# EAGLE design teensy-jst_01.1 (EAGLE 9.7.0)
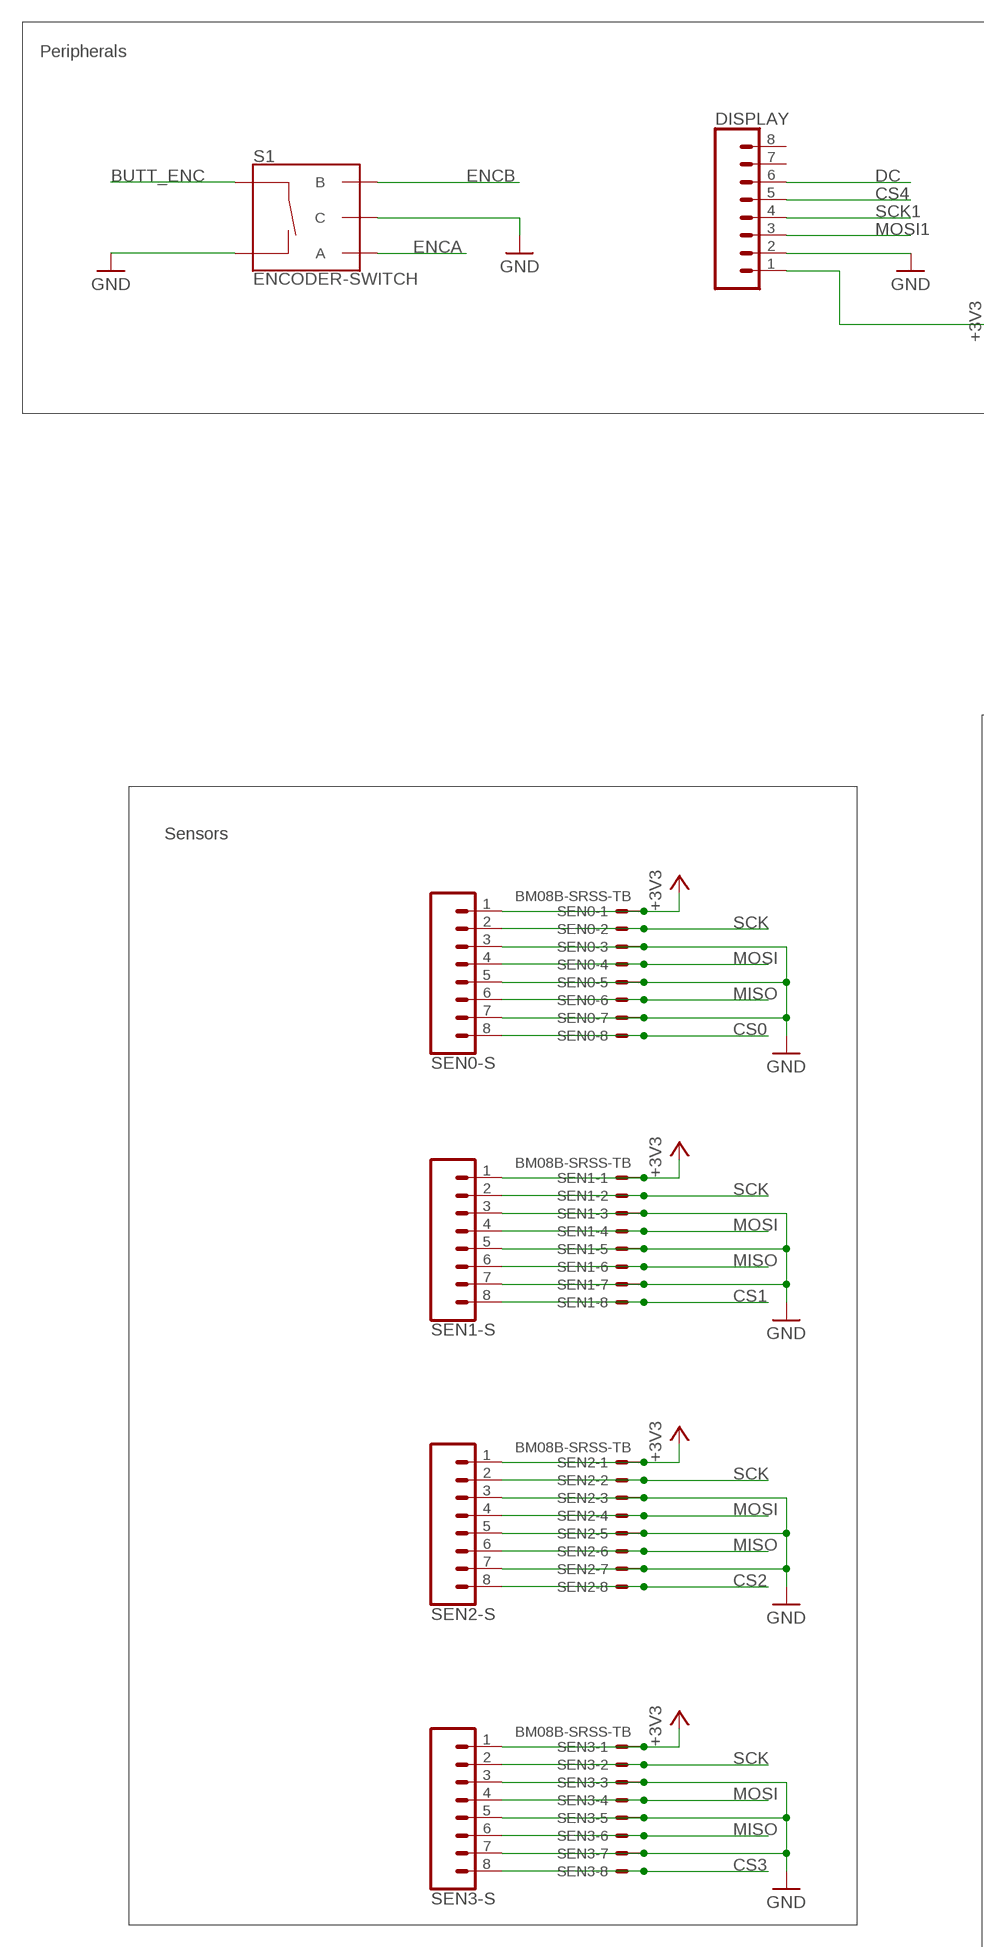
[diagram p0: schematic, sheet 1, part 1 of 2]
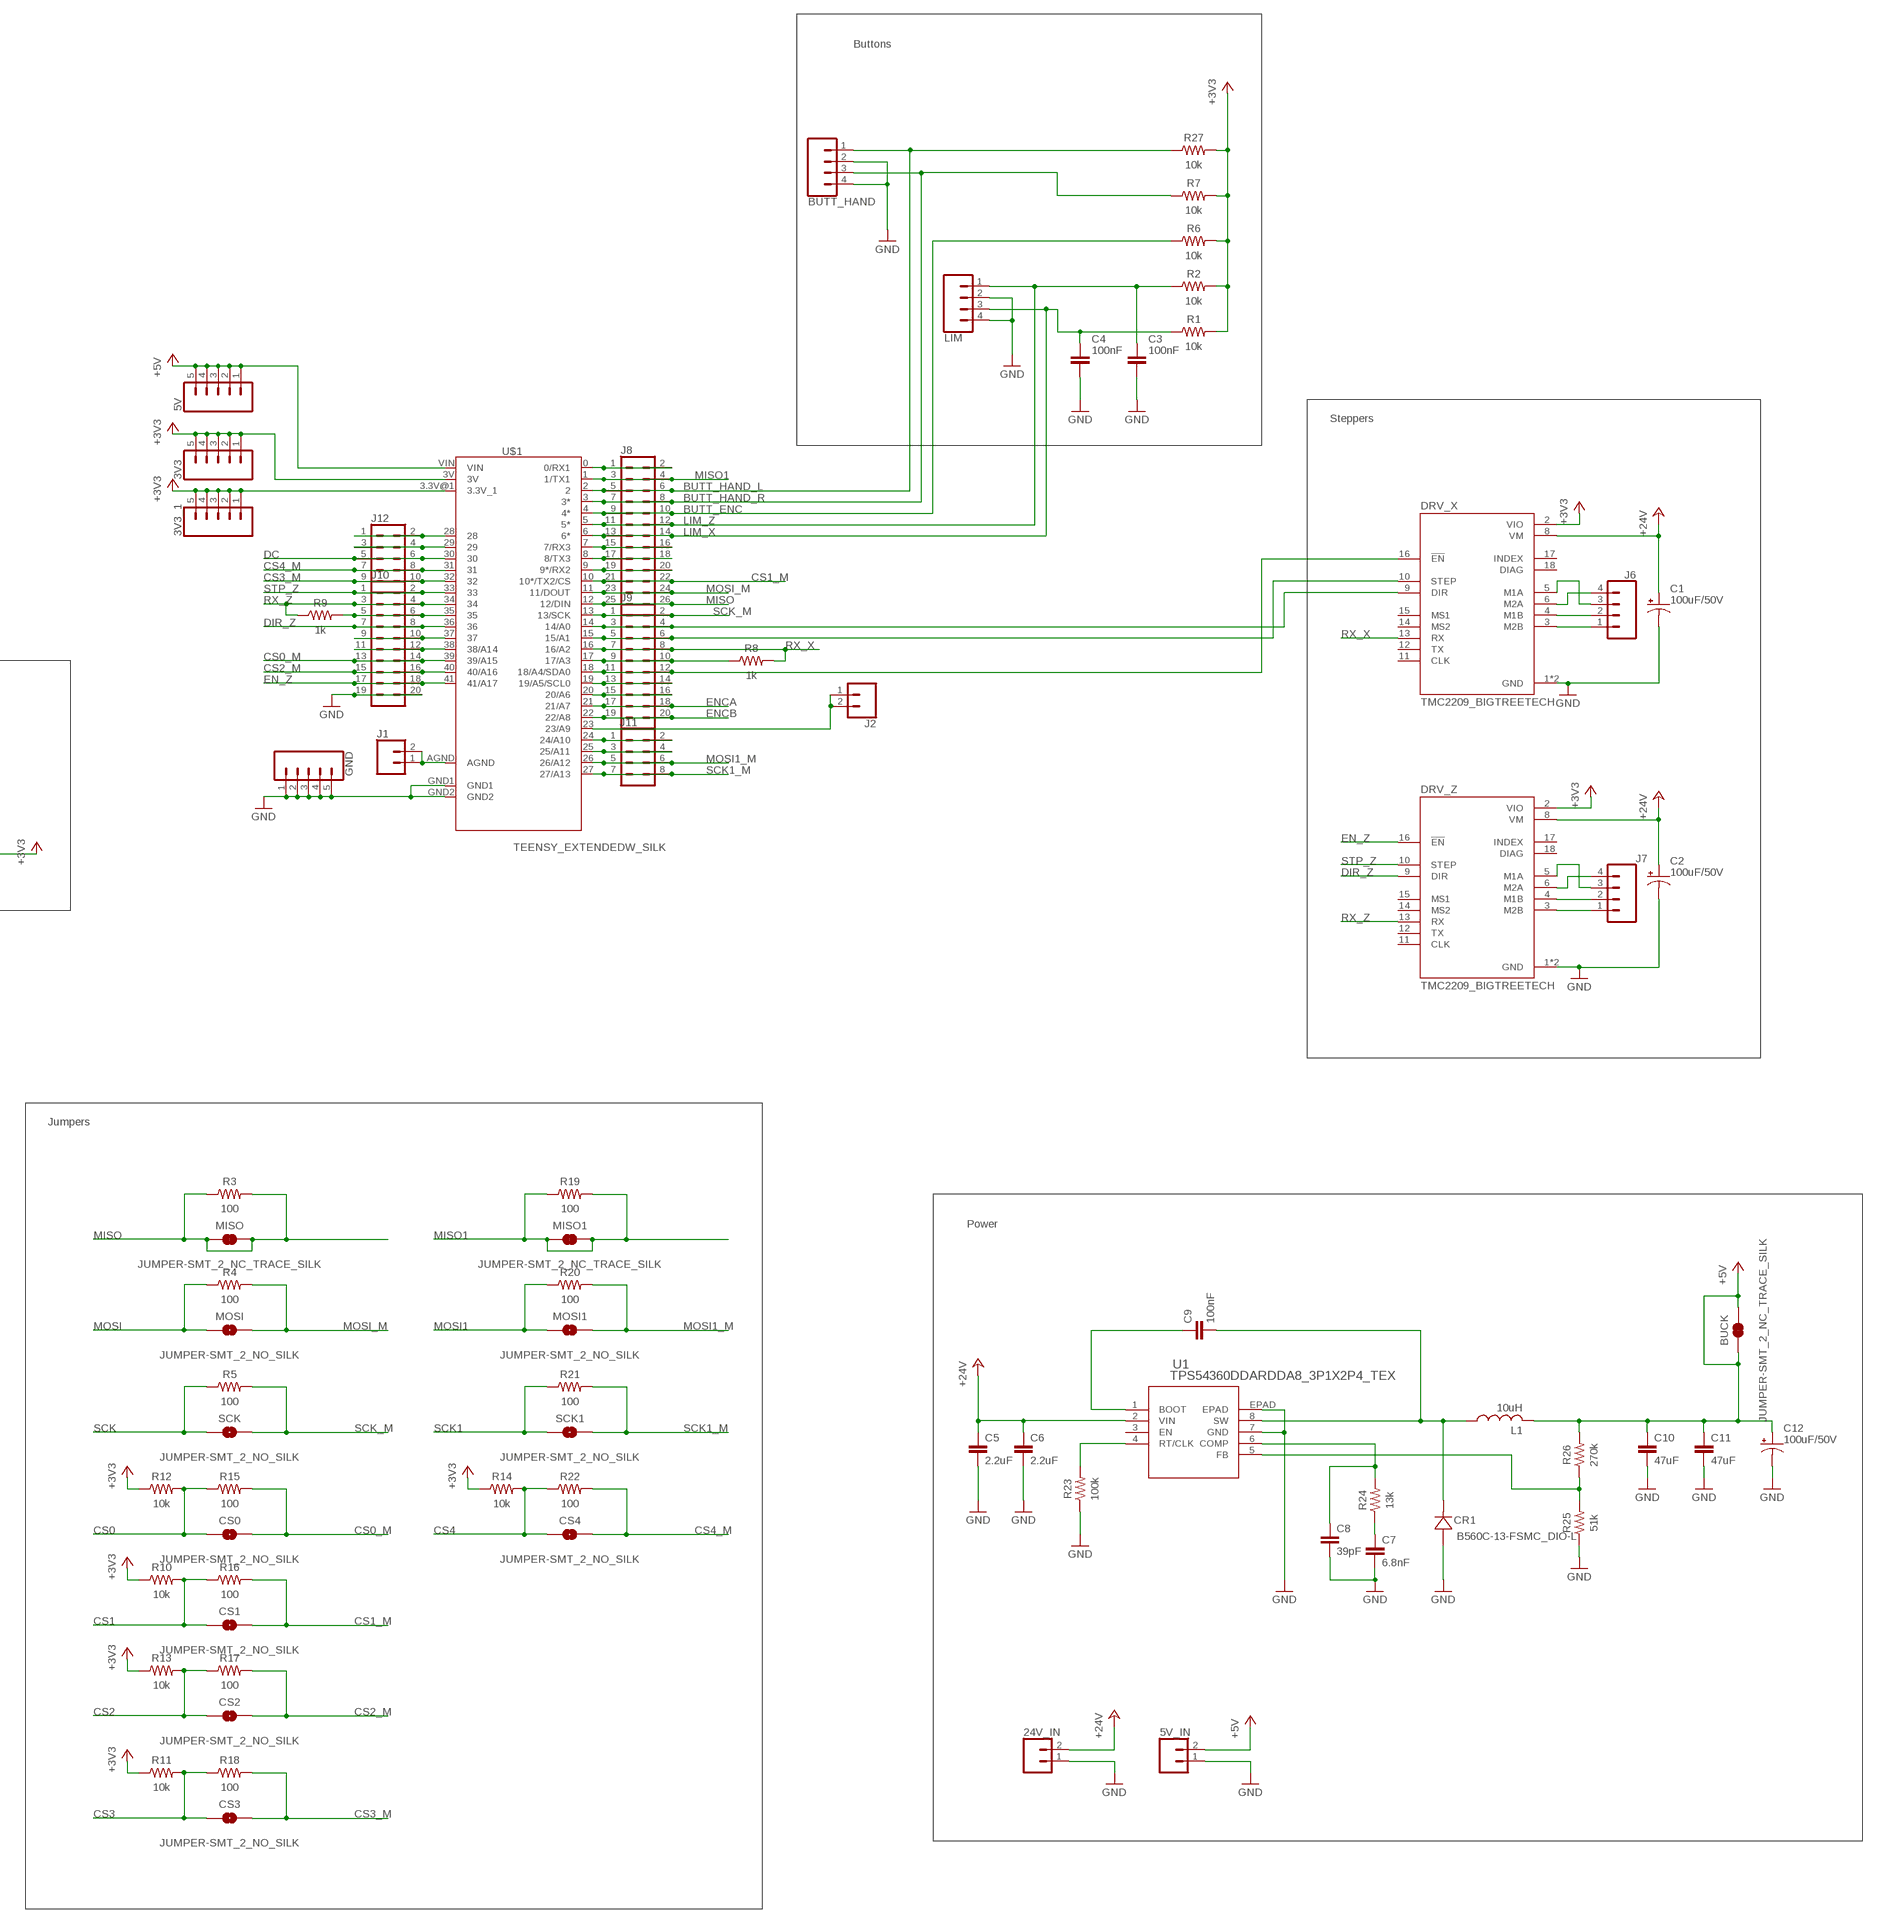
[diagram p1: schematic, sheet 1, part 2 of 2]

## Parts
3V3  CONN_05PTH  [1X05]
3V3_1  CONN_05PTH  [1X05]
5V  CONN_05PTH  [1X05]
5V_IN  CONN_025MM  [SCREWTERMINAL-5MM-2]
24V_IN  CONN_025MM  [SCREWTERMINAL-5MM-2]
BUCK  JUMPER-SMT_2_NC_TRACE_SILK  [SMT-JUMPER_2_NC_TRACE_SILK]
BUTT_HAND  CONN_041X04_NO_SILK  [1X04_NO_SILK]
C1  100uF/50V  CPOL-USE5-6  [E5-6]
C2  100uF/50V  CPOL-USE5-6  [E5-6]
C3  100nF  C-EUC0603  [C0603]
C4  100nF  C-EUC0603  [C0603]
C5  2.2uF  C-EUC0603  [C0603]
C6  2.2uF  C-EUC0603  [C0603]
C7  6.8nF  C-EUC0402  [C0402]
C8  39pF  C-EUC0402  [C0402]
C9  100nF  C-EUC0402  [C0402]
C10  47uF  C-EUC0603  [C0603]
C11  47uF  C-EUC0603  [C0603]
C12  100uF/50V  CPOL-USE5-6  [E5-6]
CR1  B560C-13-FSMC_DIO-L  [SMC_DIO-L]
CS0  JUMPER-SMT_2_NO_SILK  [SMT-JUMPER_2_NO_SILK]
CS1  JUMPER-SMT_2_NO_SILK  [SMT-JUMPER_2_NO_SILK]
CS2  JUMPER-SMT_2_NO_SILK  [SMT-JUMPER_2_NO_SILK]
CS3  JUMPER-SMT_2_NO_SILK  [SMT-JUMPER_2_NO_SILK]
CS4  JUMPER-SMT_2_NO_SILK  [SMT-JUMPER_2_NO_SILK]
DISPLAY  CONN_08"  [1X08]
DRV_X  TMC2209_BIGTREETECH  [MODULE_TMC2209_BIGTREETECH]
DRV_Z  TMC2209_BIGTREETECH  [MODULE_TMC2209_BIGTREETECH]
GND  CONN_05PTH  [1X05]
J1  CONN_02  [1X02]
J2  CONN_02  [1X02]
J6  CONN_04PTH  [1X04]
J7  CONN_04PTH  [1X04]
J8  CONN_13X22X13  [2X13]
J9  CONN_10X2  [2X10]
J10  CONN_10X2  [2X10]
J11  CONN_04X2  [2X4]
J12  CONN_05X2PTH  [2X5]
L1  10uH  L-USMWSA0503S-100MT  [MWSA0503S-100MT]
LIM  CONN_041X04_NO_SILK  [1X04_NO_SILK]
MISO  JUMPER-SMT_2_NC_TRACE_SILK  [SMT-JUMPER_2_NC_TRACE_SILK]
MISO1  JUMPER-SMT_2_NC_TRACE_SILK  [SMT-JUMPER_2_NC_TRACE_SILK]
MOSI  JUMPER-SMT_2_NO_SILK  [SMT-JUMPER_2_NO_SILK]
MOSI1  JUMPER-SMT_2_NO_SILK  [SMT-JUMPER_2_NO_SILK]
R1  10k  R-US_CHIP-0603(1608-METRIC)  [RESC1608X60]
R2  10k  R-US_CHIP-0603(1608-METRIC)  [RESC1608X60]
R3  100  R-US_CHIP-0603(1608-METRIC)  [RESC1608X60]
R4  100  R-US_CHIP-0603(1608-METRIC)  [RESC1608X60]
R5  100  R-US_CHIP-0603(1608-METRIC)  [RESC1608X60]
R6  10k  R-US_CHIP-0603(1608-METRIC)  [RESC1608X60]
R7  10k  R-US_CHIP-0603(1608-METRIC)  [RESC1608X60]
R8  1k  R-US_CHIP-0603(1608-METRIC)  [RESC1608X60]
R9  1k  R-US_CHIP-0603(1608-METRIC)  [RESC1608X60]
R10  10k  R-US_CHIP-0603(1608-METRIC)  [RESC1608X60]
R11  10k  R-US_CHIP-0603(1608-METRIC)  [RESC1608X60]
R12  10k  R-US_CHIP-0603(1608-METRIC)  [RESC1608X60]
R13  10k  R-US_CHIP-0603(1608-METRIC)  [RESC1608X60]
R14  10k  R-US_CHIP-0603(1608-METRIC)  [RESC1608X60]
R15  100  R-US_CHIP-0603(1608-METRIC)  [RESC1608X60]
R16  100  R-US_CHIP-0603(1608-METRIC)  [RESC1608X60]
R17  100  R-US_CHIP-0603(1608-METRIC)  [RESC1608X60]
R18  100  R-US_CHIP-0603(1608-METRIC)  [RESC1608X60]
R19  100  R-US_CHIP-0603(1608-METRIC)  [RESC1608X60]
R20  100  R-US_CHIP-0603(1608-METRIC)  [RESC1608X60]
R21  100  R-US_CHIP-0603(1608-METRIC)  [RESC1608X60]
R22  100  R-US_CHIP-0603(1608-METRIC)  [RESC1608X60]
R23  100k  R-US_CHIP-0402(1005-METRIC)  [RESC1005X40]
R24  13k  R-US_CHIP-0402(1005-METRIC)  [RESC1005X40]
R25  51k  R-US_CHIP-0402(1005-METRIC)  [RESC1005X40]
R26  270k  R-US_CHIP-0402(1005-METRIC)  [RESC1005X40]
R27  10k  R-US_CHIP-0603(1608-METRIC)  [RESC1608X60]
S1  ENCODER-SWITCH  [ROTARY_ENC_PLAIN]
SCK  JUMPER-SMT_2_NO_SILK  [SMT-JUMPER_2_NO_SILK]
SCK1  JUMPER-SMT_2_NO_SILK  [SMT-JUMPER_2_NO_SILK]
SEN0  BM08B-SRSS-TB  [BM08B-SRSS-TB]
SEN0-S  CONN_08"  [1X08]
SEN1  BM08B-SRSS-TB  [BM08B-SRSS-TB]
SEN1-S  CONN_08"  [1X08]
SEN2  BM08B-SRSS-TB  [BM08B-SRSS-TB]
SEN2-S  CONN_08"  [1X08]
SEN3  BM08B-SRSS-TB  [BM08B-SRSS-TB]
SEN3-S  CONN_08"  [1X08]
U1  TPS54360DDARDDA8_3P1X2P4_TEX  [DDA8_3P1X2P4_TEX]
U$1  TEENSY_EXTENDEDW_SILK  [TEENSY_EXTENDED]

## Nets
+3V3: 3V3.1 3V3.2 3V3.3 3V3.4 3V3.5 3V3_1.1 3V3_1.2 3V3_1.3 3V3_1.4 3V3_1.5 DISPLAY.1 DRV_X.2(VIO) DRV_Z.2(VIO) R1.2 R2.2 R6.2 R7.2 R10.1 R11.1 R12.1 R13.1 R14.1 R27.2 SEN0-S.1 SEN0.1 SEN1-S.1 SEN1.1 SEN2-S.1 SEN2.1 SEN3-S.1 SEN3.1 U$1.3.3V@1(3.3V_1) U$1.3V
+5V: 5V.1 5V.2 5V.3 5V.4 5V.5 5V_IN.2 BUCK.1 BUCK.2 C10.1 C11.1 C12.+ L1.2 R26.2 U$1.VIN
+24V: 24V_IN.2 C1.+ C2.+ C5.1 C6.1 DRV_X.8(VM) DRV_Z.8(VM) U1.2(VIN)
BUTT_ENC: J8.9 J8.10 R6.1 S1.SW+ U$1.4(4*)
BUTT_HAND_L: BUTT_HAND.1 J8.5 J8.6 R27.1 U$1.2
BUTT_HAND_R: BUTT_HAND.3 J8.7 J8.8 R7.1 U$1.3(3*)
CS0: CS0.1 R12.2 R15.1 SEN0-S.8 SEN0.8
CS0_M: CS0.2 J10.13 J10.14 R15.2 U$1.39(39/A15)
CS1: CS1.1 R10.2 R16.1 SEN1-S.8 SEN1.8
CS1_M: CS1.2 J8.21 J8.22 R16.2 U$1.10(10*/TX2/CS)
CS2: CS2.1 R13.2 R17.1 SEN2-S.8 SEN2.8
CS2_M: CS2.2 J10.15 J10.16 R17.2 U$1.40(40/A16)
CS3: CS3.1 R11.2 R18.1 SEN3-S.8 SEN3.8
CS3_M: CS3.2 J12.9 J12.10 R18.2 U$1.32
CS4: CS4.1 DISPLAY.5 R14.2 R22.1
CS4_M: CS4.2 J12.7 J12.8 R22.2 U$1.31
DC: DISPLAY.6 J12.5 J12.6 U$1.30
DIR_Z: DRV_Z.9(DIR) J10.7 J10.8 U$1.36
EN_Z: DRV_Z.16(!EN) J10.17 J10.18 U$1.41(41/A17)
ENCA: J9.17 J9.18 S1.A U$1.21(21/A7)
ENCB: J9.19 J9.20 S1.B U$1.22(22/A8)
GND: 5V_IN.1 24V_IN.1 BUTT_HAND.2 BUTT_HAND.4 C1.- C2.- C3.2 C4.2 C5.2 C6.2 C7.2 C8.2 C10.2 C11.2 C12.- CR1.2 DISPLAY.2 DRV_X.1(GND) DRV_X.7(GND) DRV_Z.1(GND) DRV_Z.7(GND) GND.1 GND.2 GND.3 GND.4 GND.5 J10.19 J10.20 LIM.2 LIM.4 R23.1 R25.1 S1.C S1.SW- SEN0-S.3 SEN0-S.5 SEN0-S.7 SEN0.3 SEN0.5 SEN0.7 SEN1-S.3 SEN1-S.5 SEN1-S.7 SEN1.3 SEN1.5 SEN1.7 SEN2-S.3 SEN2-S.5 SEN2-S.7 SEN2.3 SEN2.5 SEN2.7 SEN3-S.3 SEN3-S.5 SEN3-S.7 SEN3.3 SEN3.5 SEN3.7 U1.7(GND) U1.EPAD U$1.GND1 U$1.GND2
LIM_X: C4.1 J8.13 J8.14 LIM.3 R1.1 U$1.6(6*)
LIM_Z: C3.1 J8.11 J8.12 LIM.1 R2.1 U$1.5(5*)
MISO: J8.25 J8.26 MISO.1 MISO.2 R3.1 R3.2 SEN0-S.6 SEN0.6 SEN1-S.6 SEN1.6 SEN2-S.6 SEN2.6 SEN3-S.6 SEN3.6 U$1.12(12/DIN)
MISO1: J8.3 J8.4 MISO1.1 MISO1.2 R19.1 R19.2 U$1.1(1/TX1)
MOSI: MOSI.1 R4.1 SEN0-S.4 SEN0.4 SEN1-S.4 SEN1.4 SEN2-S.4 SEN2.4 SEN3-S.4 SEN3.4
MOSI1: DISPLAY.3 MOSI1.1 R20.1
MOSI1_M: J11.5 J11.6 MOSI1.2 R20.2 U$1.26(26/A12)
MOSI_M: J8.23 J8.24 MOSI.2 R4.2 U$1.11(11/DOUT)
MS1_Z: J10.9 J10.10 U$1.37
MS2_Z: J10.11 J10.12 U$1.38(38/A14)
N$1: J12.1 J12.2 U$1.28
N$3: J11.1 J11.2 U$1.24(24/A10)
N$4: J1.1 J1.2 U$1.AGND
N$5: J2.1 J2.2 U$1.23(23/A9)
N$6: J12.3 J12.4 U$1.29
N$7: R23.2 U1.4(RT/CLK)
N$8: J8.15 J8.16 U$1.7(7/RX3)
N$10: C7.1 R24.1
N$11: DRV_X.9(DIR) J9.3 J9.4 U$1.14(14/A0)
N$12: DRV_Z.6(M2A) J7.4
N$13: DRV_X.10(STEP) J9.5 J9.6 U$1.15(15/A1)
N$14: C8.1 R24.2 U1.6(COMP)
N$15: DRV_Z.5(M1A) J7.3
N$16: J9.13 J9.14 U$1.19(19/A5/SCL0)
N$17: DRV_X.6(M2A) J6.4
N$18: DRV_X.5(M1A) J6.3
N$19: R25.2 R26.1 U1.5(FB)
N$20: DRV_Z.4(M1B) J7.2
N$21: DRV_Z.3(M2B) J7.1
N$22: J11.3 J11.4 U$1.25(25/A11)
N$24: DRV_X.4(M1B) J6.2
N$25: DRV_X.3(M2B) J6.1
N$26: J9.15 J9.16 U$1.20(20/A6)
N$27: DRV_X.16(!EN) J9.11 J9.12 U$1.18(18/A4/SDA0)
N$28: J9.9 J9.10 R8.1 U$1.17(17/A3)
N$30: C9.2 CR1.1 L1.1 U1.8(SW)
N$32: C9.1 U1.1(BOOT)
N$33: J8.17 J8.18 U$1.8(8/TX3)
N$37: J8.1 J8.2 U$1.0(0/RX1)
N$39: J8.19 J8.20 U$1.9(9*/RX2)
N$41: J10.5 J10.6 R9.2 U$1.35
RX_X: DRV_X.13(RX) J9.7 J9.8 R8.2 U$1.16(16/A2)
RX_Z: DRV_Z.13(RX) J10.3 J10.4 R9.1 U$1.34
SCK: R5.1 SCK.1 SEN0-S.2 SEN0.2 SEN1-S.2 SEN1.2 SEN2-S.2 SEN2.2 SEN3-S.2 SEN3.2
SCK1: DISPLAY.4 R21.1 SCK1.1
SCK1_M: J11.7 J11.8 R21.2 SCK1.2 U$1.27(27/A13)
SCK_M: J9.1 J9.2 R5.2 SCK.2 U$1.13(13/SCK)
STP_Z: DRV_Z.10(STEP) J10.1 J10.2 U$1.33
Unconnected: DISPLAY.7 DISPLAY.8 DRV_X.11(CLK) DRV_X.12(TX) DRV_X.14(MS2) DRV_X.15(MS1) DRV_X.17(INDEX) DRV_X.18(DIAG) DRV_Z.11(CLK) DRV_Z.12(TX) DRV_Z.14(MS2) DRV_Z.15(MS1) DRV_Z.17(INDEX) DRV_Z.18(DIAG) U1.3(EN)

## Notes on the sheet
- Buttons
- Steppers
- Peripherals
- Jumpers
- Sensors
- Power

## Library data of the parts
3V3 3V3_1 5V GND = SparkFun-Connectors:CONN_05: Multi connection point. Often used as Generic Header-pin footprint for 0.1 inch spaced/style header connections On any of the 0.1 inch spaced packages, you can populate with these: Break Away Headers - Straight <https://www.sparkfun.com/products/116> (PRT-00116) Break Away Male Headers - Right Angle <https://www.sparkfun.com/products/553> (PRT-00553) Female Headers <https://www.sparkfun.com/products/115> (PRT-00115) Break Away Headers - Machine Pin <https://www.sparkfun.com/products/117> (PRT-00117) Break Away Female Headers - Swiss Machine Pin <https://www.sparkfun.com/products/743> (PRT-00743) For SCREWTERMINALS and SPRING TERMINALS visit here: Screw Terimnals on SparkFun.com <https://www.sparkfun.com/search/results?term=Screw+Terminals> (5mm/3.5mm/2.54mm spacing) This device is also useful as a general connection point to wire up your design to another part of your project. Our various solder wires solder well into these plated through hole pads. Hook-Up Wire - Assortment (Stranded, 22 AWG) <https://www.sparkfun.com/products/11375> (PRT-11375) Hook-Up Wire - Assortment (Solid Core, 22 AWG) <https://www.sparkfun.com/products/11367> (PRT-11367) View the entire wire category on our website here <https://www.sparkfun.com/categories/141> Special notes: Molex polarized connector foot print use with SKU : PRT-08231 with associated crimp pins and housings. 1MM SMD Version SKU: PRT-10208
5V_IN 24V_IN = SparkFun-Connectors:CONN_02: Multi connection point. Often used as Generic Header-pin footprint for 0.1 inch spaced/style header connections On any of the 0.1 inch spaced packages, you can populate with these: Break Away Headers - Straight <https://www.sparkfun.com/products/116> (PRT-00116) Break Away Male Headers - Right Angle <https://www.sparkfun.com/products/553> (PRT-00553) Female Headers <https://www.sparkfun.com/products/115> (PRT-00115) Break Away Headers - Machine Pin <https://www.sparkfun.com/products/117> (PRT-00117) Break Away Female Headers - Swiss Machine Pin <https://www.sparkfun.com/products/743> (PRT-00743) For SCREWTERMINALS and SPRING TERMINALS visit here: Screw Terimnals on SparkFun.com <https://www.sparkfun.com/search/results?term=Screw+Terminals> (5mm/3.5mm/2.54mm spacing) This device is also useful as a general connection point to wire up your design to another part of your project. Our various solder wires solder well into these plated through hole pads. Hook-Up Wire - Assortment (Stranded, 22 AWG) <https://www.sparkfun.com/products/11375> (PRT-11375) Hook-Up Wire - Assortment (Solid Core, 22 AWG) <https://www.sparkfun.com/products/11367> (PRT-11367) View the entire wire category on our website here <https://www.sparkfun.com/categories/141> Special notes: Molex polarized connector foot print use with: PRT-08233 with associated crimp pins and housings. 2.54_SCREWTERM for use with PRT-10571. 3.5mm Screw Terminal footprints for PRT-08084 5mm Screw Terminal footprints for use with PRT-08432; SF_SKU: PRT-08432
BUCK MISO MISO1 = SparkFun-Jumpers:JUMPER-SMT_2_NC_TRACE: Normally closed trace jumper This jumper has a trace between two pads so it's normally closed (NC). Use a razor knife to open the connection. For best results follow the IPC guidelines for cutting traces: Cutout at least 0.063 mm (0.005 in). Remove all loose material to clean up the cut area. Seal the cut with an approved epoxy. Reapply solder to reclose the connection.
BUTT_HAND J6 J7 LIM = SparkFun-Connectors:CONN_04: Multi connection point. Often used as Generic Header-pin footprint for 0.1 inch spaced/style header connections On any of the 0.1 inch spaced packages, you can populate with these: Break Away Headers - Straight <https://www.sparkfun.com/products/116> (PRT-00116) Break Away Male Headers - Right Angle <https://www.sparkfun.com/products/553> (PRT-00553) Female Headers <https://www.sparkfun.com/products/115> (PRT-00115) Break Away Headers - Machine Pin <https://www.sparkfun.com/products/117> (PRT-00117) Break Away Female Headers - Swiss Machine Pin <https://www.sparkfun.com/products/743> (PRT-00743) For SCREWTERMINALS and SPRING TERMINALS visit here: Screw Terimnals on SparkFun.com <https://www.sparkfun.com/search/results?term=Screw+Terminals> (5mm/3.5mm/2.54mm spacing) This device is also useful as a general connection point to wire up your design to another part of your project. Our various solder wires solder well into these plated through hole pads. Hook-Up Wire - Assortment (Stranded, 22 AWG) <https://www.sparkfun.com/products/11375> (PRT-11375) Hook-Up Wire - Assortment (Solid Core, 22 AWG) <https://www.sparkfun.com/products/11367> (PRT-11367) View the entire wire category on our website here <https://www.sparkfun.com/categories/141> Special notes: Molex polarized connector foot print use with SKU : PRT-08231 with associated crimp pins and housings. 1MM SMD Version SKU: PRT-10208; PROD_ID: CONN-09696
C1 C2 C12 = rcl:CPOL-US: POLARIZED CAPACITOR, American symbol; SPICEPREFIX: C
C3-C11 = rcl:C-EU: CAPACITOR, European symbol; SPICEPREFIX: C
CR1 = 2024-09-23_20-34-24_Library:B560C-13-F; COPYRIGHT: Copyright (C) 2024 Ultra Librarian. All rights reserved.; MANUFACTURER_PART_NUMBER: B560C-13-F; MFR_NAME: Diodes Inc
CS0 CS1-CS4 MOSI MOSI1 SCK SCK1 = SparkFun-Jumpers:JUMPER-SMT_2_NO: Normally open jumper This jumper has two pads in close proximity to each other. Apply solder to close the connection. Round pads are easier to solder for beginners, but are a lot larger. SparkFun Product that uses the round pads: SparkFun EL Sequencer <https://www.sparkfun.com/products/12781>
DISPLAY SEN0-S SEN1-S SEN2-S SEN3-S = SparkFun-Connectors:CONN_08: Multi connection point. Often used as Generic Header-pin footprint for 0.1 inch spaced/style header connections On any of the 0.1 inch spaced packages, you can populate with these: Break Away Headers - Straight <https://www.sparkfun.com/products/116> (PRT-00116) Break Away Male Headers - Right Angle <https://www.sparkfun.com/products/553> (PRT-00553) Female Headers <https://www.sparkfun.com/products/115> (PRT-00115) Break Away Headers - Machine Pin <https://www.sparkfun.com/products/117> (PRT-00117) Break Away Female Headers - Swiss Machine Pin <https://www.sparkfun.com/products/743> (PRT-00743) Arduino Stackable Header - 8 Pin <https://www.sparkfun.com/products/9279> (PRT-09279) For SCREWTERMINALS and SPRING TERMINALS visit here: Screw Terimnals on SparkFun.com <https://www.sparkfun.com/search/results?term=Screw+Terminals> (5mm/3.5mm/2.54mm spacing) This device is also useful as a general connection point to wire up your design to another part of your project. Our various solder wires solder well into these plated through hole pads. Hook-Up Wire - Assortment (Stranded, 22 AWG) <https://www.sparkfun.com/products/11375> (PRT-11375) Hook-Up Wire - Assortment (Solid Core, 22 AWG) <https://www.sparkfun.com/products/11367> (PRT-11367) View the entire wire category on our website here <https://www.sparkfun.com/categories/141> Special notes: Molex polarized connector foot print use with SKU : PRT-08231 with associated crimp pins and housings. 1MM SMD Version SKU: PRT-10208 NOTES ON THE VARIANTS LOCK and LOCK_LONGPADS... This footprint was designed to help hold the alignment of a through-hole component (i.e. 6-pin header) while soldering it into place. You may notice that each hole has been shifted either up or down by 0.005 of an inch from it's more standard position (which is a perfectly straight line). This slight alteration caused the pins (the squares in the middle) to touch the edges of the holes. Because they are alternating, it causes a "brace" to hold the component in place. 0.005 has proven to be the perfect amount of "off-center" position when using our standard breakaway headers. Although looks a little odd when you look at the bare footprint, once you have a header in there, the alteration is very hard to notice. Also,if you push a header all the way into place, it is covered up entirely on the bottom side.; PROD_ID: CONN-08438
DRV_X DRV_Z = TMC2209_BIGTREETECH:TMC2209_BIGTREETECH: Check availability <https://pricing.snapeda.com/parts/TMC2209%20SILENTSTEPSTICK/Trinamic%20Motion%20Control%20GmbH/view-part?ref=eda>; AVAILABILITY: In Stock; CHECK_PRICES: https://www.snapeda.com/parts/TMC2209%20SILENTSTEPSTICK/Trinamic+Motion+Control+GmbH/view-part/?ref=eda; DESCRIPTION: TMC2209 Motor Controller/Driver Power Management Evaluation Board; MF: Trinamic Motion Control GmbH; MP: TMC2209 SILENTSTEPSTICK; PACKAGE: None; PRICE: None; SNAPEDA_LINK: https://www.snapeda.com/parts/TMC2209%20SILENTSTEPSTICK/Trinamic+Motion+Control+GmbH/view-part/?ref=snap
J1 J2 = SparkFun-Connectors:CONN_02: Multi connection point. Often used as Generic Header-pin footprint for 0.1 inch spaced/style header connections On any of the 0.1 inch spaced packages, you can populate with these: Break Away Headers - Straight <https://www.sparkfun.com/products/116> (PRT-00116) Break Away Male Headers - Right Angle <https://www.sparkfun.com/products/553> (PRT-00553) Female Headers <https://www.sparkfun.com/products/115> (PRT-00115) Break Away Headers - Machine Pin <https://www.sparkfun.com/products/117> (PRT-00117) Break Away Female Headers - Swiss Machine Pin <https://www.sparkfun.com/products/743> (PRT-00743) For SCREWTERMINALS and SPRING TERMINALS visit here: Screw Terimnals on SparkFun.com <https://www.sparkfun.com/search/results?term=Screw+Terminals> (5mm/3.5mm/2.54mm spacing) This device is also useful as a general connection point to wire up your design to another part of your project. Our various solder wires solder well into these plated through hole pads. Hook-Up Wire - Assortment (Stranded, 22 AWG) <https://www.sparkfun.com/products/11375> (PRT-11375) Hook-Up Wire - Assortment (Solid Core, 22 AWG) <https://www.sparkfun.com/products/11367> (PRT-11367) View the entire wire category on our website here <https://www.sparkfun.com/categories/141> Special notes: Molex polarized connector foot print use with: PRT-08233 with associated crimp pins and housings. 2.54_SCREWTERM for use with PRT-10571. 3.5mm Screw Terminal footprints for PRT-08084 5mm Screw Terminal footprints for use with PRT-08432
J8 = SparkFun-Connectors:CONN_13X2: Multi connection point. Often used as Generic Header-pin footprint for 0.1 inch spaced/style header connections On any of the 0.1 inch spaced packages, you can populate with these: Break Away Headers - Straight <https://www.sparkfun.com/products/116> (PRT-00116) Break Away Male Headers - Right Angle <https://www.sparkfun.com/products/553> (PRT-00553) Female Headers <https://www.sparkfun.com/products/115> (PRT-00115) Break Away Headers - Machine Pin <https://www.sparkfun.com/products/117> (PRT-00117) Break Away Female Headers - Swiss Machine Pin <https://www.sparkfun.com/products/743> (PRT-00743)
J9 J10 = SparkFun-Connectors:CONN_10X2: Multi connection point. Often used as Generic Header-pin footprint for 0.1 inch spaced/style header connections On any of the 0.1 inch spaced packages, you can populate with these: Break Away Headers - Straight <https://www.sparkfun.com/products/116> (PRT-00116) Break Away Male Headers - Right Angle <https://www.sparkfun.com/products/553> (PRT-00553) Female Headers <https://www.sparkfun.com/products/115> (PRT-00115) Break Away Headers - Machine Pin <https://www.sparkfun.com/products/117> (PRT-00117) Break Away Female Headers - Swiss Machine Pin <https://www.sparkfun.com/products/743> (PRT-00743) Special note about the "SPECIAL" package: This was SPECIALLY designed to be used with our Graphic LCD Backpack. Be sure you want to use this! It is not only staggered on each line of header holes, but IT IS ALSO offset of the center point of the top and bottom lines by 5 mil. This causes the headers to lock into place on the "standard" footprint on the LCD screen. The extra squares on the tdocu layer are there simply to reference other pins (if you were to actually populate a longer header than ten long - this is what we do with the backpacks).
J11 = SparkFun-Connectors:CONN_04X2: Multi connection point. Often used as Generic Header-pin footprint for 0.1 inch spaced/style header connections On any of the 0.1 inch spaced packages, you can populate with these: Break Away Headers - Straight <https://www.sparkfun.com/products/116> (PRT-00116) Break Away Male Headers - Right Angle <https://www.sparkfun.com/products/553> (PRT-00553) Female Headers <https://www.sparkfun.com/products/115> (PRT-00115) Break Away Headers - Machine Pin <https://www.sparkfun.com/products/117> (PRT-00117) Break Away Female Headers - Swiss Machine Pin <https://www.sparkfun.com/products/743> (PRT-00743)
J12 = SparkFun-Connectors:CONN_05X2: Multi connection point. Often used as Generic Header-pin footprint for 0.1 inch spaced/style header connections For AVR SPI programming port, see special device with nice symbol: "AVR_SPI_PROG_5x2.dev" You can populate with any combo of single row headers, but if you'd like an exact match, check these: 2x5 AVR ICSP Male Header <https://www.sparkfun.com/products/778> (PRT-00778) 2x5 Pin Shrouded Header <https://www.sparkfun.com/products/8506> (PRT-08506) On any of the 0.1 inch spaced packages, you can populate with these: Break Away Headers - Straight <https://www.sparkfun.com/products/116> (PRT-00116) Break Away Male Headers - Right Angle <https://www.sparkfun.com/products/553> (PRT-00553) Female Headers <https://www.sparkfun.com/products/115> (PRT-00115) Break Away Headers - Machine Pin <https://www.sparkfun.com/products/117> (PRT-00117) Break Away Female Headers - Swiss Machine Pin <https://www.sparkfun.com/products/743> (PRT-00743) Special note: the shrouded connector mates well with our 5x2 ribbon cables: 2x5 Pin IDC Ribbon Cable <https://www.sparkfun.com/products/8535> (PRT-08535); PROD_ID: CONN-08499; SF_ID: PRT-0778
L1 = rcl-buck:L-US: INDUCTOR, American symbol
R1-R27 = Resistor:R-US: Resistor Fixed - ANSI; CATEGORY: Resistor; SUB-CATEGORY: Fixed
S1 = SparkFun-Switches:ENCODER-SWITCH: Rotary Encoder w/ Select Switch Encoders rotate similarly to potentiometers, but they’re different from potentiometers in that an encoder has full rotation without limits. They output gray code so that you can tell how much and in which direction the encoder has been turned. This encoder includes a push-down select switch built into the shaft. SparkFun Products Rotary Encoder <https://www.sparkfun.com/products/9117> (COM-09117); SF_SKU: COM-09117
SEN0 SEN1-SEN3 = con-jst2:?M08B-SRSS-TB: Disconnectable Crimp style connector, 1.0mm pitch 8 contacts
U1 = 2024-09-23_20-06-51_Library:TPS54360DDAR; COPYRIGHT: Copyright (C) 2024 Ultra Librarian. All rights reserved.; MANUFACTURER_PART_NUMBER: TPS54360DDAR; MFR_NAME: Texas Instruments
U$1 = TEENSY-4.1_CLEAN:TEENSY_EXTENDED: Teensy Footprint Extended Mechanical footprint with connectors for Teensy Development Board with ARM Cortex. SparkFun Products: Teensy 4.1 <https://www.sparkfun.com/products/16771> Teensy 3.6 <https://www.sparkfun.com/products/14057> Teensy 3.5 <https://www.sparkfun.com/products/14055> SparkFun Qwiic Shield for Teensy Extended <https://www.sparkfun.com/products/17156> Teensy Stackable Header Kit (Longer Version) <https://www.sparkfun.com/products/17152>

## Board
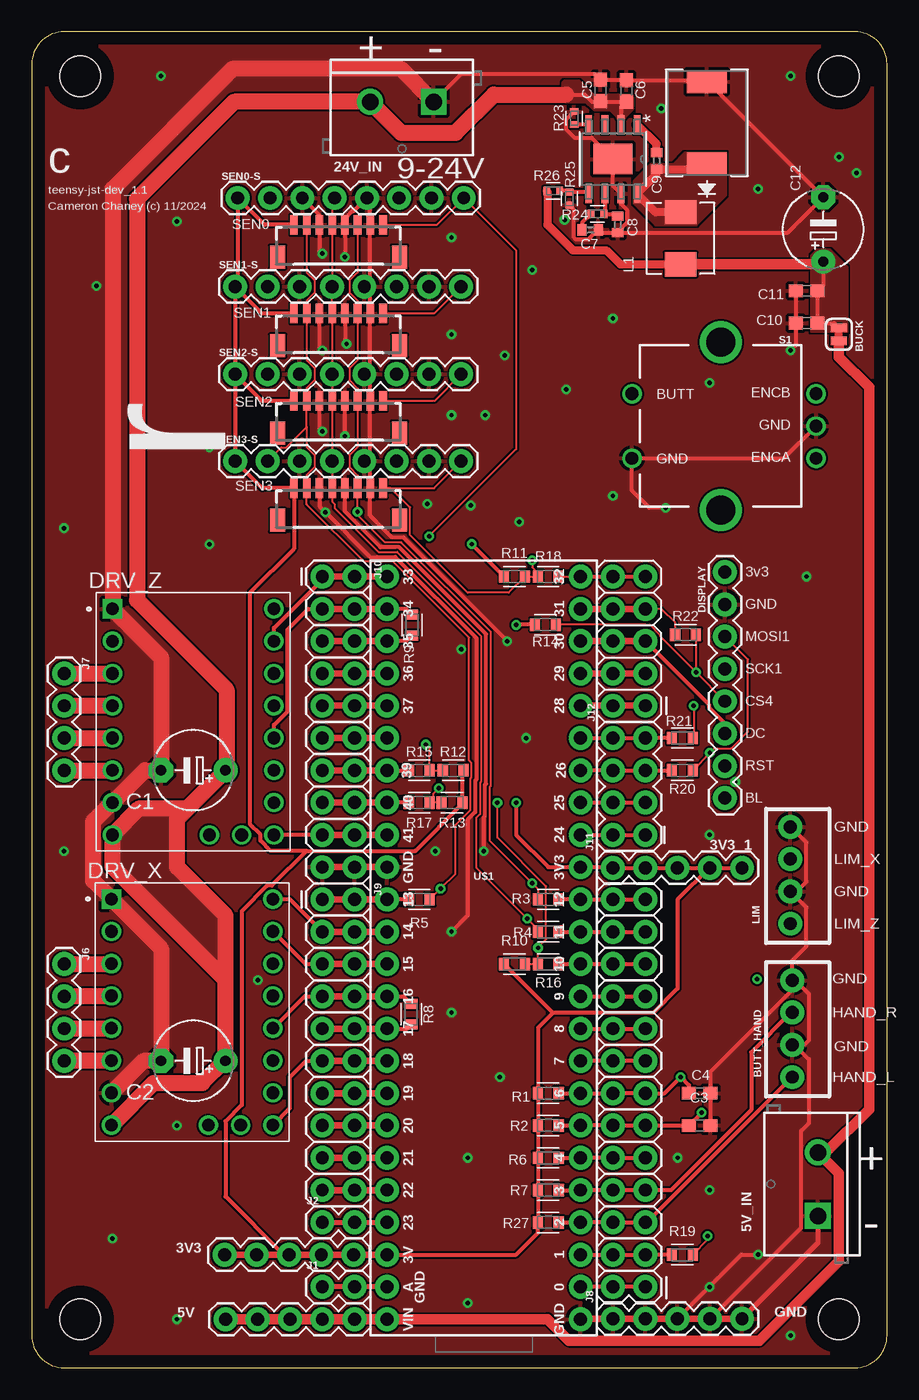
[diagram p2: board, top side]
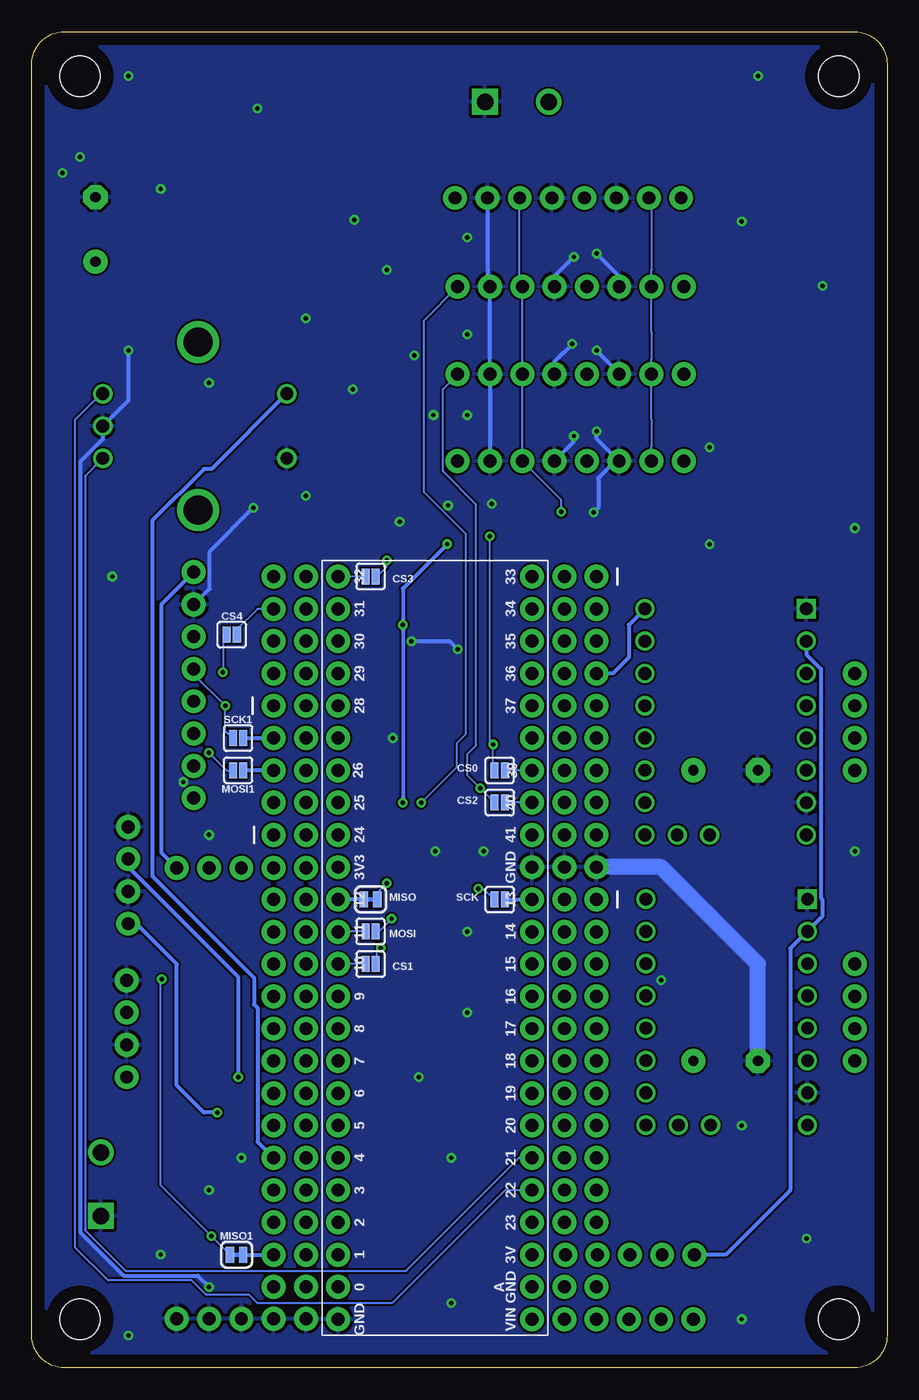
[diagram p3: board, bottom side, seen from below]

Size 67.29 x 105.08 mm. Coordinates in mm from the lower left corner, seen from the top.
Outline: 0,102.54 0,2.54 arc90 2.54,0 64.75,0 arc90 67.29,2.54 67.29,102.54 arc90 64.75,105.08 2.54,105.08 arc90 0,102.54
Copper layers (1*16): Top 0.035mm / dielectric 1.5mm / Bottom 0.035mm
Design rules "Fusion Electronics Design Rules": minimum track width 6mil, minimum drill 0.35mm, track to track 6mil, track to pad 6mil, pad to pad 6mil, via to via 6mil, smd to smd 6mil, copper to edge 40mil, drill to drill 6mil, minimum pad ring 10mil, minimum via ring 8mil, stop-mask expansion 4mil, vias tented up to drill 0mil, thermal gap 10mil
Holes 3.2 mm at 3.81,3.81 63.5,3.81 3.81,101.6 63.5,101.6

### Footprints (pad centres in the part's own frame; a part is rotated, then mirrored left to right if it is on the bottom)
1X05 = drill 1.016 pad 1.88: 1 0,0; 2 2.54,0; 3 5.08,0; 4 7.62,0; 5 10.16,0
SCREWTERMINAL-5MM-2 = drill 1.3 pad 2.032 square: 1 0,0 | drill 1.3 pad 2.032: 2 5,0
SMT-JUMPER_2_NC_TRACE_SILK = smd 0.66 x 1.27: 1 -0.521,0; 2 0.521,0
1X04_NO_SILK = drill 1.016 pad 1.88: 1 0,0; 2 2.54,0; 3 5.08,0; 4 7.62,0
E5-6 = drill 0.813 pad 1.905: + -2.54,0 | drill 0.813 pad 1.905 octagon: - 2.54,0
C0603 = smd 1.1 x 1: 1 -0.85,0; 2 0.85,0
C0402 = smd 0.7 x 0.9: 1 -0.65,0; 2 0.65,0
SMC_DIO-L = smd 1.799 x 3.129: 1 -3.241,0; 2 3.241,0
SMT-JUMPER_2_NO_SILK = smd 0.635 x 1.27: 1 -0.406,0; 2 0.406,0
1X08 = drill 1.016 pad 1.88: 1 0,0; 2 2.54,0; 3 5.08,0; 4 7.62,0; 5 10.16,0; 6 12.7,0; 7 15.24,0; 8 17.78,0
MODULE_TMC2209_BIGTREETECH = drill 1 square: 1 -6.35,8.89 | drill 1: 2 -6.35,6.35; 3 -6.35,3.81; 4 -6.35,1.27; 5 -6.35,-1.27; 6 -6.35,-3.81; 7 -6.35,-6.35; 8 -6.35,-8.89; 9 6.35,8.89; 10 6.35,6.35; 11 6.35,3.81; 12 6.35,1.27; 13 6.35,-1.27; 14 6.35,-3.81; 15 6.35,-6.35; 16 6.35,-8.89; 17 1.27,-8.89; 18 3.81,-8.89
1X02 = drill 1.016 pad 1.88: 1 0,0; 2 2.54,0
1X04 = drill 1.016 pad 1.88: 1 0,0; 2 2.54,0; 3 5.08,0; 4 7.62,0
2X13 = drill 1.016 pad 1.88: 1 0,0; 2 0,2.54; 3 2.54,0; 4 2.54,2.54; 5 5.08,0; 6 5.08,2.54; 7 7.62,0; 8 7.62,2.54; 9 10.16,0; 10 10.16,2.54; 11 12.7,0; 12 12.7,2.54; 13 15.24,0; 14 15.24,2.54; 15 17.78,0; 16 17.78,2.54; 17 20.32,0; 18 20.32,2.54; 19 22.86,0; 20 22.86,2.54; 21 25.4,0; 22 25.4,2.54; 23 27.94,0; 24 27.94,2.54; 25 30.48,0; 26 30.48,2.54
2X10 = drill 1.016 pad 1.88: 1 0,0; 2 0,2.54; 3 2.54,0; 4 2.54,2.54; 5 5.08,0; 6 5.08,2.54; 7 7.62,0; 8 7.62,2.54; 9 10.16,0; 10 10.16,2.54; 11 12.7,0; 12 12.7,2.54; 13 15.24,0; 14 15.24,2.54; 15 17.78,0; 16 17.78,2.54; 17 20.32,0; 18 20.32,2.54; 19 22.86,0; 20 22.86,2.54
2X4 = drill 1.016 pad 1.88: 1 -3.81,-1.27; 2 -3.81,1.27; 3 -1.27,-1.27; 4 -1.27,1.27; 5 1.27,-1.27; 6 1.27,1.27; 7 3.81,-1.27; 8 3.81,1.27
2X5 = drill 1.016 pad 1.88: 1 0,0; 2 0,2.54; 3 2.54,0; 4 2.54,2.54; 5 5.08,0; 6 5.08,2.54; 7 7.62,0; 8 7.62,2.54; 9 10.16,0; 10 10.16,2.54
MWSA0503S-100MT = smd 1.9 x 2.499: 1 2.05,0; 2 -2.05,0
RESC1608X60 = smd 0.799 x 0.974: 1 -0.815,0; 2 0.815,0
RESC1005X40 = smd 0.535 x 0.644: 1 -0.507,0; 2 0.507,0
ROTARY_ENC_PLAIN = drill 1.016: A 7.493,-2.54; B 7.493,2.54; C 7.493,0; SW+ -6.985,2.54; SW- -6.985,-2.54 | drill 2.286: P$3 0,6.604; P$4 0,-6.604
BM08B-SRSS-TB = smd 0.6 x 1.55: 1 3.5,-1.625; 2 2.5,-1.625; 3 1.5,-1.625; 4 0.5,-1.625; 5 -0.5,-1.625; 6 -1.5,-1.625; 7 -2.5,-1.625; 8 -3.5,-1.625 | smd 1.2 x 1.8: FIT@1 4.8,0.9; FIT@2 -4.8,0.9
DDA8_3P1X2P4_TEX = smd 1.46 x 0.533: 1 -2.724,1.905; 2 -2.724,0.635; 3 -2.724,-0.635; 4 -2.724,-1.905; 5 2.724,-1.905; 6 2.724,-0.635; 7 2.724,0.635; 8 2.724,1.905 | smd 2.4 x 3.1: EPAD 0,0
TEENSY_EXTENDED = drill 1.016 pad 1.88: 0 7.62,-13.97; 1 7.62,-11.43; 2 7.62,-8.89; 3 7.62,-6.35; 3.3V@1 7.62,19.05; 3V -7.62,-11.43; 4 7.62,-3.81; 5 7.62,-1.27; 6 7.62,1.27; 7 7.62,3.81; 8 7.62,6.35; 9 7.62,8.89; 10 7.62,11.43; 11 7.62,13.97; 12 7.62,16.51; 13 -7.62,16.51; 14 -7.62,13.97; 15 -7.62,11.43; 16 -7.62,8.89; 17 -7.62,6.35; 18 -7.62,3.81; 19 -7.62,1.27; 20 -7.62,-1.27; 21 -7.62,-3.81; 22 -7.62,-6.35; 23 -7.62,-8.89; 24 7.62,21.59; 25 7.62,24.13; 26 7.62,26.67; 27 7.62,29.21; 28 7.62,31.75; 29 7.62,34.29; 30 7.62,36.83; 31 7.62,39.37; 32 7.62,41.91; 33 -7.62,41.91; 34 -7.62,39.37; 35 -7.62,36.83; 36 -7.62,34.29; 37 -7.62,31.75; 38 -7.62,29.21; 39 -7.62,26.67; 40 -7.62,24.13; 41 -7.62,21.59; AGND -7.62,-13.97; GND1 7.62,-16.51; GND2 -7.62,19.05; VIN -7.62,-16.51

### Placement (x,y rotation side)
3V3  15.16,8.89 0 top
3V3_1  45.72,39.32 0 top
5V  15.24,3.81 0 top
5V_IN  61.85,11.94 90 top
24V_IN  31.62,99.57 180 top
BUCK  63.5,81.28 90 top
BUTT_HAND  59.82,22.86 90 top
C1  12.7,46.99 180 top
C2  12.7,24.13 180 top
C3  52.55,19.05 0 top
C4  52.55,21.59 0 top
C5  44.73,100.46 90 top
C6  46.78,100.44 90 top
C7  43.94,89.5 0 top
C8  46.1,89.92 270 top
C9  49.15,94.93 270 top
C10  60.96,82.17 180 top
C11  60.96,84.71 180 top
C12  62.27,89.53 90 top
CR1  53.12,97.92 90 top
CS0  30.48,46.99 0 bottom
CS1  40.64,31.75 180 bottom
CS2  30.48,44.45 0 bottom
CS3  40.64,62.23 180 bottom
CS4  51.56,57.66 0 bottom
DISPLAY  54.54,62.58 270 top
DRV_X  12.62,27.97 0 top
DRV_Z  12.7,50.8 0 top
GND  45.72,3.86 0 top
J1  22.86,6.35 0 top
J2  22.86,11.43 0 top
J6  2.54,31.75 270 top
J7  2.54,54.61 270 top
J8  48.26,6.35 90 top
J9  22.86,36.83 270 top
J10  22.86,62.23 270 top
J11  46.99,45.72 90 top
J12  48.26,52.07 90 top
L1  51.04,88.83 90 top
LIM  59.69,34.92 90 top
MISO  40.64,36.83 0 bottom
MISO1  51.18,8.89 180 bottom
MOSI  40.64,34.32 180 bottom
MOSI1  51.05,46.99 0 bottom
R1  40.64,21.59 180 top
R2  40.64,19.05 180 top
R3  40.64,36.83 0 top
R4  40.64,34.29 0 top
R5  30.48,36.83 180 top
R6  40.64,16.51 180 top
R7  40.64,13.97 180 top
R8  29.85,27.81 90 top
R9  29.92,58.42 270 top
R10  37.97,31.75 0 top
R11  37.97,62.23 0 top
R12  33.15,46.99 180 top
R13  33.06,44.45 180 top
R14  40.41,58.45 0 top
R15  30.48,46.99 180 top
R16  40.64,31.75 0 top
R17  30.48,44.45 180 top
R18  40.64,62.23 0 top
R19  51.18,8.89 0 top
R20  51.18,46.99 180 top
R21  51.18,49.53 180 top
R22  51.44,57.66 180 top
R23  42.67,98.3 270 top
R24  44.5,90.75 0 top
R25  42.29,91.95 90 top
R26  41.02,92.56 180 top
R27  40.64,11.43 180 top
S1  54.21,74.07 0 top
SCK  30.48,36.83 0 bottom
SCK1  51.05,49.53 0 bottom
SEN0  24.13,88.27 180 top
SEN0-S  16.21,92.01 0 top
SEN1  24.13,81.3 180 top
SEN1-S  16,85.04 0 top
SEN2  24.13,74.42 180 top
SEN2-S  16,78.15 0 top
SEN3  24.13,67.56 180 top
SEN3-S  16,71.31 0 top
U1  45.72,95.06 270 top
U$1  35.56,20.32 0 top

### Tracks (layer width: path | path; a pad name or v marks a point on that pad's centre or on a via)
+3V3  (via drill 0.35)
  Top 0.305: 3V3_1.4 3V3_1.3 3V3_1.2 3V3_1.1 45.67,39.37 U$1.3.3V@1 40.64,39.37 38.1,41.91 v38.1,44.45 | 3V3_1.4 3V3_1.5 | 40.99,27.91 48.9,27.91 50.8,29.82 50.8,36.83 53.29,39.32 3V3_1.4 | 22.86,8.89 3V3.4 19.83,8.89 15.24,13.48 15.24,19.39 16.51,20.66 16.51,35.9 18.53,37.92 18.87,37.92 21.62,40.66 | R12.1 33.88,46.9 R13.1 33.88,44.36 30.18,40.66 21.62,40.66 | R10.1 40.99,27.91 | v34.6,64.79 R11.1 | 40.99,27.91 39.83,26.75 R1.2 R2.2 R6.2 R7.2 R27.2 39.83,10.62 38.1,8.89 U$1.3V | R14.1 38.13,58.45 v38.1,58.42 | 21.62,40.66 18.8,40.66 17.99,41.47 17.99,41.93 17.2,42.72 17.2,60.96 20.63,64.39 SEN3.1 18.12,69.19 SEN3-S.1 SEN2-S.1 | SEN2.1 18.11,76.05 SEN2-S.1 | SEN1.1 18.12,82.92 SEN1-S.1 | SEN0.1 18.33,89.89 SEN0-S.1 16.21,85.25 SEN1-S.1 | SEN1-S.1 SEN2-S.1
  Top 0.508: 3V3.1 3V3.2 3V3.3 3V3.4 3V3.5 | 22.86,8.89 3V3.5 | 3V3.5 U$1.3V
  Bottom 0.305: 3V3.1 12.7,8.89 7.62,13.97 7.62,32.97 DRV_X.2 5.08,35.51 5.08,36.83 5.21,36.96 5.21,54.97 6.35,56.11 DRV_Z.2 | 3V3_1.5 57.1,40.54 57.1,60.02 DISPLAY.1 | v34.6,64.79 38.1,61.29 v38.1,58.42 v38.1,44.45
+5V
  Top 0.305: C12.+ 62.27,85.17 C11.1 C10.1 63.13,82.17 BUCK.2
  Top 0.61: L1.2 46.29,86.78 45.19,87.88 42.56,87.88 40.55,89.9 40.55,92.53 R26.2 | BUCK.1 BUCK.2
  Top 0.813: 5V.1 5V.2 5V.3 5V.4 5V.5 U$1.VIN 40.59,3.81 42.26,2.13 57.26,2.13 63.5,8.38 63.5,15.29 5V_IN.2 62.49,16.94 65.87,20.32 65.87,77.12 63.5,79.49 BUCK.1 | L1.2 62.06,86.78 C12.+
  pour Top (isolate 0.254, no thermals): 61.29,81.48 64.19,81.48 64.19,86.58 62.83,87.93 61.75,87.93 61.29,87.47
+24V
  Top 0.305: U1.2 46.36,99.17 C6.1 44.75,99.59 C5.1 44.7,99.57 44.07,99.57 43.51,100.13 42.04,100.13
  Top 1.27: C2.+ 15.24,30.51 6.35,39.4 DRV_Z.8 8.42,43.98 12.23,43.98 C1.+ | C2.+ 15.24,35.56 11.43,39.37 11.43,43.18 C1.+ | C1.+ 15.33,47.08 15.33,53.33 8.28,60.38 8.28,91.95 15.9,99.57 24V_IN.2 29.06,97.13 33.35,97.13 36.34,100.13 42.04,100.13 | DRV_X.8 9.58,22.39 13.42,22.39 15.16,24.13 C2.+
  pour Top (isolate 0.254, no thermals): 45.62,99.18 45.72,99.13 46.3,98.55 46.35,98.45 46.36,98.45 46.36,98.45 46.41,98.55 46.96,99.1 46.96,99.8 44.14,99.8 44.04,99.82 43.95,99.88 42.88,100.94 42.06,100.94 42.06,99.85 43.61,99.85 43.72,99.82 43.81,99.77 44.36,99.21 45.52,99.21
  pour Top (no thermals): 6.43,41.88 6.43,39.57 6.49,39.57 6.52,39.56 15.04,31.04 15.04,36.04 11.37,39.71 11.35,39.74 11.35,43.87 8.33,43.87 8.33,43.8 8.32,43.77
BUTT_ENC
  Top 0.305: J8.9 J8.10 U$1.4 R6.1
  Bottom 0.305: S1.SW+ 53.14,70.69 53.75,70.69 57.81,66.63 57.81,38.68 49.81,30.68 49.81,28.57 49.53,28.29 49.53,17.78 J8.9
BUTT_HAND_L
  Top 0.305: BUTT_HAND.1 48.39,11.43 J8.5 J8.6 U$1.2 R27.1
BUTT_HAND_R
  Top 0.305: R7.1 U$1.3 J8.8 J8.7 50.28,13.97 56.59,20.28 56.59,24.82 59.71,27.94 BUTT_HAND.3
CS0  (via drill 0.35)
  Top 0.152: R12.2 R15.1 31.3,48.72 v30.99,49.02 | SEN0.8 31.86,89.89 SEN0-S.8 38.1,87.9 38.1,72.24 v31.27,65.41
  Bottom 0.152: v31.27,65.41 31.27,49.3 v30.99,49.02 30.99,47 CS0.1
CS0_M
  Top 0.305: U$1.39 R15.2
  Top 0.508: J10.13 J10.14 U$1.39
  Bottom 0.152: U$1.39 CS0.2
CS1  (via drill 0.35)
  Top 0.152: v36.64,44.45 36.64,41.69 40.45,37.88 40.45,33.71 39.83,33.08 v39.83,33.02 R16.1 R10.2 | SEN1-S.8 31.66,82.92 SEN1.8
  Bottom 0.152: v39.83,33.02 40.12,32.73 40.12,31.86 CS1.1 | v36.64,44.45 33.83,47.25 33.83,49.15 33.15,49.83 33.15,65.56 36.45,68.86 36.45,82.38 SEN1-S.8
CS1_M
  Top 0.305: J8.21 J8.22 U$1.10 R16.2
  Bottom 0.152: CS1.2 U$1.10
CS2  (via drill 0.35)
  Top 0.152: v32.01,45.59 31.59,45.17 31.59,44.74 R17.1 R13.2 | SEN2-S.8 31.68,76.05 SEN2.8
  Bottom 0.152: CS2.1 31,44.58 v32.01,45.59 33.02,46.6 33.02,48.26 32.33,48.95 32.33,67.89 34.95,70.51 34.95,76.98 SEN2-S.8
CS2_M
  Top 0.305: R17.2 U$1.40
  Top 0.508: U$1.40 J10.16 J10.15
  Bottom 0.152: U$1.40 CS2.2
CS3  (via drill 0.35)
  Top 0.152: v39.37,63.5 39.37,62.94 39.83,62.48 R18.1 R11.2 37.52,60.96 34.29,60.96 29.76,65.49 29.76,67.66 28.23,69.19 SEN3.8 31.66,69.19 SEN3-S.8
  Bottom 0.152: v39.37,63.5 39.37,62.98 40.12,62.23 CS3.1
CS3_M
  Top 0.152: R18.2 U$1.32
  Top 0.305: U$1.32 J12.10 J12.9
  Bottom 0.152: CS3.2 U$1.32
CS4  (via drill 0.35)
  Top 0.152: v52.25,54.71 DISPLAY.5 | R14.2 48.26,58.45 48.62,58.45 49.43,57.63 49.43,57.53 v52.25,54.71 | R22.1 v52.25,54.71
  Bottom 0.152: CS4.1 52.25,57.49 v52.25,54.71
CS4_M
  Top 0.152: R22.2 50.62,58.6 49.53,59.69 J12.7
  Top 0.508: U$1.31 J12.8 J12.7
  Bottom 0.152: J12.7 49.53,59.69 51.16,58.06 CS4.2
DC
  Top 0.305: J12.5 53.3,52.11 53.3,51.91 54.54,50.66 DISPLAY.6
  Top 0.508: J12.5 J12.6 U$1.30
DIR_Z
  Top 0.508: U$1.36 J10.8 J10.7
  Bottom 0.305: DRV_Z.9 20.32,58.42 20.32,55.88 21.59,54.61 J10.7
EN_Z
  Top 0.305: J10.17 DRV_Z.16
  Top 0.508: J10.17 J10.18 U$1.41
ENCA
  Top 0.508: J9.17 J9.18 U$1.21
  Bottom 0.152: U$1.21 28.96,16.51 37.85,7.62 59.89,7.62 63.09,10.83 63.09,70.14 S1.A
ENCB
  Top 0.508: U$1.22 J9.20 J9.19
  Bottom 0.152: U$1.22 30.05,13.97 38.94,5.08 49.53,5.08 50.19,5.74 53.59,5.74 54.71,6.86 61.28,6.86 63.86,9.44 63.86,74.59 61.83,76.61 S1.B
GND  (via drill 0.35)
  Top 0.305: GND.5 55.86,3.83 55.83,3.81 | 53.31,6.38 GND.3 53.39,3.86 60.53,11 60.53,18.62 61.14,19.23 61.14,24.26 59.99,25.4 BUTT_HAND.2 60.78,25.4 61.14,25.76 61.14,29.39 60.05,30.48 BUTT_HAND.4 | S1.SW- 59.16,71.53 S1.C | v35.56,40.64 35.56,43.31 35.65,43.4 35.65,45.85 35.73,45.94 35.73,57.71 28.9,64.54 27.43,64.54 24.63,67.34 SEN3.5 | v33.02,34.29 34.29,35.56 34.29,43.12 34.89,43.71 34.89,46.16 34.97,46.25 34.97,57.39 28.58,63.78 26.61,63.78 v23.1,67.29 22.64,67.74 22.64,69.17 SEN3.3 | 46.86,71.53 S1.SW- | R25.1 42.64,91.09 42.64,88.93 42.82,88.75 43.77,88.75 44.52,89.5 C7.2 44.83,89.27 C8.2 | C8.2 46.1,89.33 46.86,90.09 46.86,91.04 46.36,91.54 U1.7 45.72,92.97 U1.EPAD 44.03,96.75 42.69,96.75 42.05,97.4 42.05,98.18 42.22,98.36 42.23,98.36 R23.1 | C11.2 C10.2 60.11,80.43 v59.69,80.01 | 24V_IN.1 33.78,101.73 44.31,101.73 C5.2 46.76,101.31 C6.2 52.98,101.29 CR1.2 53.19,101.16 C12.- 59.46,89.27 C8.2 | v53.34,6.35 53.31,6.38 | 53.31,6.38 55.83,8.89 v57.15,8.89 | BUTT_HAND.4 59.82,32.02 60.94,33.14 60.94,36.22 LIM.2 60.18,37.47 60.94,38.22 60.94,41.3 LIM.4 | BUTT_HAND.4 59.82,29.7 53.4,23.28 C4.2 C3.2 | S1.SW- 47.22,68.99 48.57,67.64 v49.86,67.64 | 54.28,60.04 DISPLAY.2 | v37.42,57.15 29.26,65.3 28.36,65.3 26.63,67.03 SEN3.7 26.63,70.84 SEN3-S.5 26.63,71.78 SEN2.7 26.63,77.68 SEN2-S.5 26.63,78.62 SEN1.7 26.63,84.58 SEN1-S.5 26.63,85.51 SEN0.7 26.63,91.75 SEN0-S.5 25.32,90.97 25.2,90.97 24.63,90.4 SEN0.5 v24.63,87.38 v24.64,87.38 | v22.86,73.66 22.63,73.89 SEN2.3 | v22.86,80.01 22.63,80.24 SEN1.3 | v22.86,87.63 22.63,87.86 SEN0.3 22.63,90.67 SEN0-S.3
  Top 0.305: SEN1.5 24.63,80.65 v24.77,80.52 | v24.64,73.28 v24.63,73.29 SEN2.5
  Top 0.406: 5V_IN.1 61.85,9.83 GND.5
  Top 0.508: U$1.GND1 43.23,3.86 GND.1 GND.2 GND.3 GND.4 55.83,3.86 55.86,3.83 | U$1.GND2 J10.20 J10.19
  Top 1.27: DRV_X.7 8.78,24.13 C2.- 10.16,32.97 DRV_X.1 4.81,38.32 4.81,42.93 6.33,44.45 DRV_Z.7 8.89,46.99 C1.- 10.16,55.88 DRV_Z.1 6.35,92.71 15.8,102.16 29.04,102.16 24V_IN.1
  Bottom 0.305: 53.66,60.93 DISPLAY.2 53.3,61.29 53.3,64.2 v49.86,67.64 | v33.78,56.52 34.42,57.15 v37.42,57.15 | v59.69,80.01 59.69,76.08 S1.C 61.7,73.04 63.48,71.27 63.48,10.67 60.04,7.24 54.23,7.24 v53.34,6.35 | SEN3-S.3 21.24,71.47 | 21.24,71.47 22.86,73.09 v22.86,73.66 | SEN2-S.3 21.08,78.23 v22.86,80.01 | 21.24,85.04 SEN1-S.3 21.08,85.85 v22.86,87.63 | v24.64,87.38 26.16,85.85 SEN1-S.5 | v24.77,80.52 26.16,79.12 SEN2-S.5 | SEN3-S.5 24.64,72.83 v24.64,73.28 | SEN0-S.7 31.45,85.25 SEN1-S.7 SEN2-S.7 SEN3-S.7 | v23.1,67.29 22.72,67.67 22.72,70 21.24,71.47
  Bottom 1.27: C2.- 10.16,31.75 17.78,39.37 J10.19
  other vias: 5.08,85.09 11.43,90.17 13.97,72.39 53.34,77.47 45.72,68.58 2.54,40.64 6.35,10.16 11.43,19.05 36.83,22.86 34.29,16.51 33.02,27.94 59.69,2.54 34.29,5.08 13.97,64.77 39.37,86.36 17.78,30.48 2.54,66.04 11.43,3.81 31.75,40.64 60.96,62.23 38.89,49.53 41.91,90.3 64.87,93.98 59.69,101.6 10.16,101.6 57.15,92.71 49.53,99.06 63.5,95.25 45.72,82.55 55.35,46.07 53.34,41.91 50.8,16.51 53.34,13.97 33.02,88.9 33.02,81.28 37.21,79.63 35.69,74.93 33.02,74.93 31.12,67.94 34.54,67.82 38.35,66.55 42.04,76.96
  pour Top (rank 2): -7.56,-6.2 76.05,-6.2 76.05,110.34 -8.74,110.34 -8.74,-5.02
  pour Bottom: -10.1,-11.28 81.13,-11.28 81.13,109.16 79.95,110.34 -11.28,110.34 -11.28,-10.1
LIM_X  (via drill 0.35)
  Top 0.305: R1.1 U$1.6 J8.14 J8.13 49.78,21.59 v51.05,22.86 51.7,22.21 C4.1
  Bottom 0.305: v51.05,22.86 51.05,30.73 59.69,39.37 LIM.3
LIM_Z  (via drill 0.35)
  Top 0.305: R2.1 U$1.5 J8.12 J8.11 C3.1 52.7,20.05 v52.7,20.08
  Bottom 0.305: LIM.1 59.06,34.92 55.88,31.75 55.88,22.2 53.76,20.08 v52.7,20.08
MISO  (via drill 0.35)
  Top 0.152: R3.1 39.83,37.65 v39.37,38.1 36.03,41.44 36.03,45.69 36.11,45.78 36.11,57.86 29.06,64.92 27.79,64.92 25.63,67.08 v25.63,67.31 SEN3.6 25.63,70.19 24.99,70.83 24.99,71.79 25.63,72.43 SEN2.6 25.63,77.03 24.99,77.67 24.99,78.64 25.63,79.27 SEN1.6 25.63,83.92 24.99,84.56 24.99,85.53 25.63,86.17 SEN0.6
  Top 0.305: J8.25 J8.26 U$1.12 R3.2
  Bottom 0.152: v39.37,38.1 40.12,37.35 MISO.2 MISO.1 | v25.63,67.31 25.63,68.24 SEN3-S.6 SEN2-S.6 SEN1-S.6 28.91,85.25 SEN0-S.6
  Bottom 0.305: MISO.1 U$1.12
MISO1  (via drill 0.35)
  Top 0.152: R19.2 53.16,10.05 v53.16,10.34 | 57.05,30.58 v57.07,30.56
  Top 0.305: U$1.1 J8.4 J8.3 R19.1
  Bottom 0.152: MISO1.1 MISO1.2 v53.16,10.34 57.15,14.34 57.15,30.48 v57.07,30.56
  Bottom 0.305: MISO1.1 J8.3
MOSI  (via drill 0.35)
  Top 0.152: R4.1 39.83,34.47 v38.99,35.31 34.95,39.34 34.95,43.24 35.27,43.55 35.27,46.01 35.35,46.09 35.35,57.55 28.74,64.16 27.28,64.16 23.83,67.61 23.83,67.92 23.63,68.12 SEN3.4 SEN3-S.4 SEN2.4 SEN2-S.4 SEN1.4 SEN1-S.4 23.63,85.05 SEN0.4 23.63,91.82 SEN0-S.4
  Bottom 0.152: v38.99,35.31 39.98,34.31 MOSI.1
MOSI1  (via drill 0.35)
  Top 0.152: 53.37,48.37 53.37,48.39 v53.35,48.36 | 54.49,57.5 DISPLAY.3 56.34,55.71 56.34,50.03 55.03,48.71 53.7,48.71 v53.35,48.36 | R20.1 53.35,48.34 v53.35,48.36
  Bottom 0.152: v53.35,48.36 51.98,46.99 MOSI1.1
MOSI1_M
  Top 0.305: U$1.26 J11.6 J11.5 R20.2
  Bottom 0.305: J11.5 MOSI1.2
MOSI_M
  Top 0.305: J8.23 J8.24 U$1.11 R4.2
  Bottom 0.152: MOSI.2 43.16,34.31 U$1.11
MS1_Z
  Top 0.508: J10.9 J10.10 U$1.37
MS2_Z
  Top 0.508: U$1.38 J10.12 J10.11
N$1
  Top 0.508: U$1.28 J12.2 J12.1
N$3
  Top 0.305: U$1.24 J11.2 J11.1
N$4
  Top 0.406: U$1.AGND J1.2 J1.1
N$5
  Top 0.406: J2.1 J2.2 U$1.23
N$6
  Top 0.508: U$1.29 J12.4 J12.3
N$7
  Top 0.305: R23.2 U1.4
N$8
  Top 0.305: U$1.7 J8.16 J8.15
N$10
  Top 0.305: R24.1 43.29,90.05 C7.1
N$11
  Top 0.305: DRV_X.9 20.29,36.86 J9.3
  Top 0.508: U$1.14 J9.4 J9.3
N$12
  Top 1.27: J7.4 DRV_Z.6
N$13
  Top 0.305: DRV_X.10 21.54,31.75 J9.5
  Top 0.508: J9.5 J9.6 U$1.15
N$14
  Top 0.305: U1.6 45.09,90.83 R24.2 45.91,90.75 C8.1
N$15
  Top 1.27: J7.3 DRV_Z.5
N$16
  Top 0.508: J9.13 J9.14 U$1.19
N$17
  Top 1.27: J6.4 2.57,24.16 DRV_X.6
N$18
  Top 1.27: J6.3 2.57,26.7 DRV_X.5
N$19
  Top 0.305: U1.5 43.7,92.46 R25.2 42.18,92.56 R26.1
N$20
  Top 1.27: J7.2 DRV_Z.4
N$21
  Top 1.27: J7.1 DRV_Z.3
N$22
  Top 0.305: U$1.25 J11.4 J11.3
N$24
  Top 1.27: J6.2 2.57,29.24 DRV_X.4
N$25
  Top 1.27: J6.1 2.57,31.78 DRV_X.3
N$26
  Top 0.508: J9.15 J9.16 U$1.20
N$27
  Top 0.305: DRV_X.16 20.32,20.43 20.32,22.86 21.59,24.13 J9.11
  Top 0.508: U$1.18 J9.12 J9.11
N$28
  Top 0.305: U$1.17 29.52,26.67 R8.1
  Top 0.508: J9.9 J9.10 U$1.17
N$30
  Top 0.61: CR1.1 52.72,94.28 C9.2 49.15,93.86 U1.8 49.08,90.88 L1.1
  pour Top (isolate 0.254, no thermals): 51.34,95.55 50.46,94.68 50.43,94.67 48.67,94.67 47.32,93.31 47.32,91.6 49.05,89.87 52.29,89.87 54.66,92.23 54.66,95.55
N$32
  Top 0.61: C9.1 49.15,96.26 U1.1
N$33
  Top 0.305: U$1.8 J8.18 J8.17
N$37
  Top 0.305: U$1.0 J8.2 J8.1
N$39
  Top 0.305: U$1.9 J8.20 J8.19
N$41
  Top 0.305: R9.2 29.46,57.15 U$1.35
  Top 0.508: J10.5 J10.6 U$1.35
RX_X
  Top 0.305: DRV_X.13 21.48,29.21 J9.7 | U$1.16 29.26,29.21 R8.2
  Top 0.508: U$1.16 J9.8 J9.7
RX_Z
  Top 0.305: DRV_Z.13 19.05,50.57 20.11,51.63 20.11,58.06 21.74,59.69 J10.3 | U$1.34 29.46,59.69 R9.1
  Top 0.508: U$1.34 J10.4 J10.3
SCK  (via drill 0.35)
  Top 0.152: R5.1 v32.16,37.69 33.32,38.85 33.32,42.68 34.51,43.87 34.51,46.32 34.59,46.41 34.59,47.57 34.4,47.76 34.4,57.42 28.42,63.4 26.13,63.4 21.63,67.9 SEN3.2 21.63,70.21 22.25,70.83 22.25,71.79 21.63,72.42 21.63,74 | SEN3-S.2 19.62,72.39 20.03,72.39 21.63,74 | 21.63,74 SEN2.2 21.63,77.05 22.25,77.67 22.25,78.64 21.63,79.26 SEN1.2 21.63,83.94 22.25,84.56 22.25,85.53 21.63,86.15 SEN0.2
  Bottom 0.152: SCK.1 31.86,37.69 v32.16,37.69 | SEN3-S.2 18.54,72.49 18.5,72.53 18.5,74.52 18.54,74.56 SEN2-S.2 18.54,79.36 18.5,79.4 18.5,81.39 18.54,81.43 SEN1-S.2 18.54,86.33 18.5,86.37 18.5,91.77 SEN0-S.2
SCK1  (via drill 0.35)
  Top 0.152: v52.07,52.07 52.07,49.6 R21.1
  Bottom 0.152: DISPLAY.4 54.54,54.54 v52.07,52.07 52.07,50.02 SCK1.1
SCK1_M
  Top 0.305: U$1.27 J11.8 J11.7 R21.2
  Bottom 0.305: SCK1.2 J11.7
SCK_M
  Top 0.305: R5.2 U$1.13
  Top 0.508: J9.1 J9.2 U$1.13
  Bottom 0.305: SCK.2 U$1.13
STP_Z
  Top 0.305: DRV_Z.10 19.05,58.19 22.86,62 J10.1
  Top 0.508: J10.1 J10.2 U$1.33

### Text on the board
tPlace: + | - | c | 9-24V | teensy-jst-dev_1.1 | Cameron Chaney (c) 11/2024 | BUTT | ENCB | r | GND | GND | ENCA | 3v3 | GND | MOSI1 | SCK1 | CS4 | DC | RST | BL | GND | LIM_X | GND | LIM_Z | GND | HAND_R | GND | HAND_L | + | -